# Altium project baseControl.PrjPCB
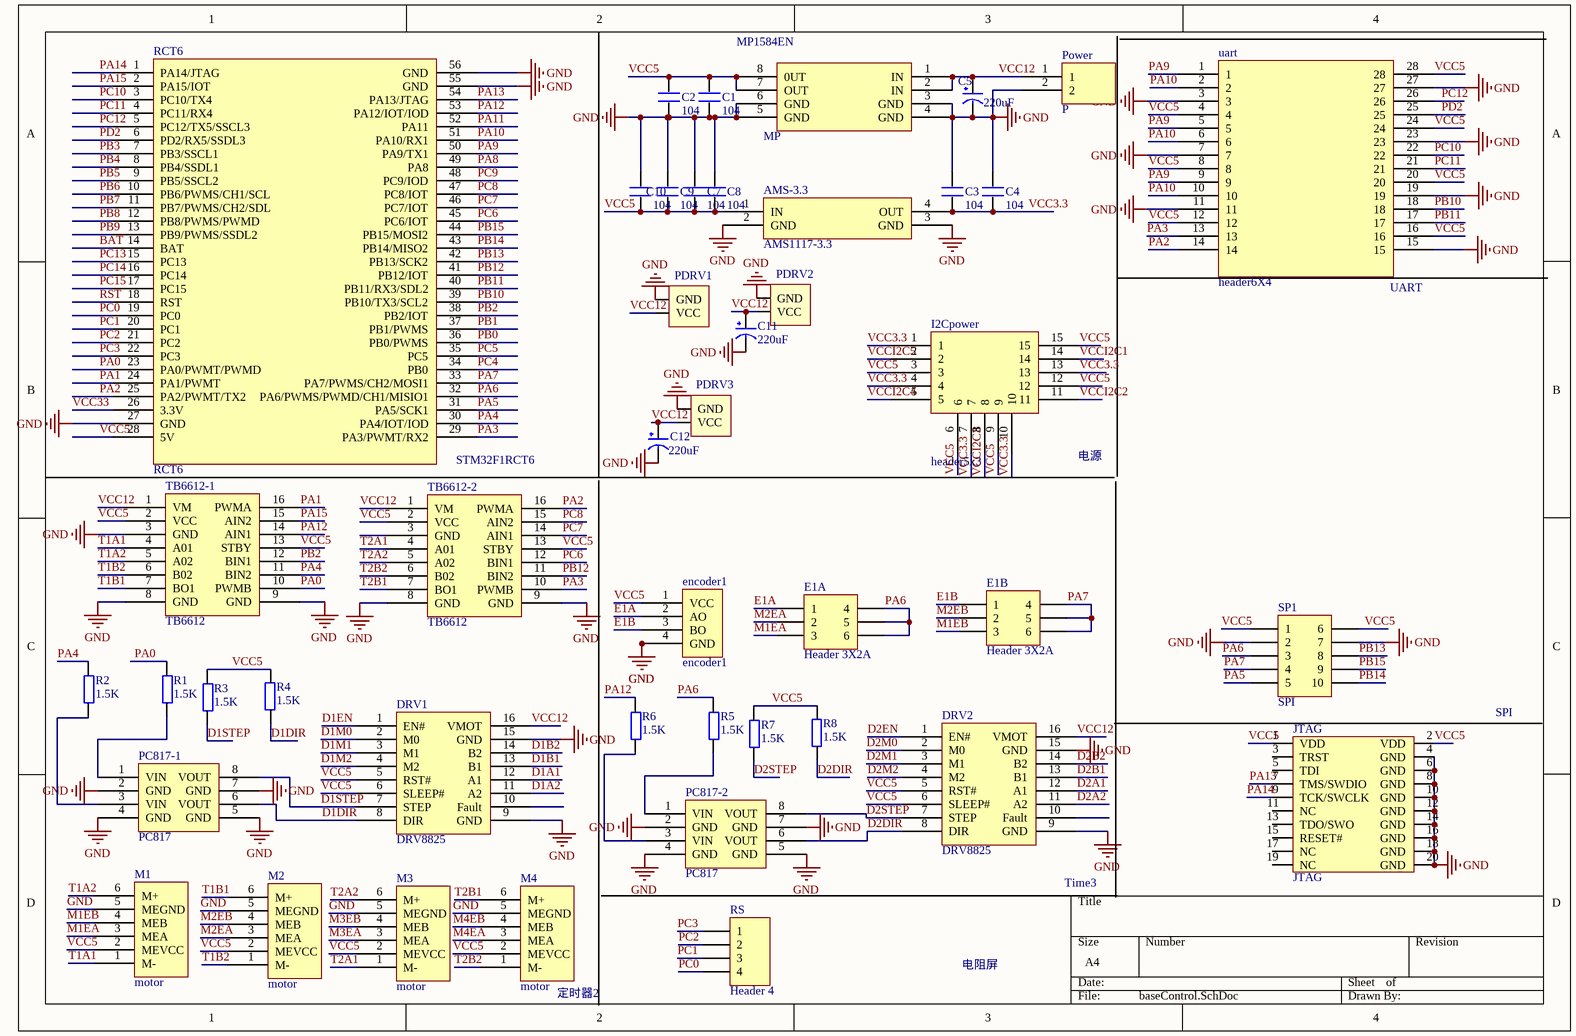
[diagram p0: baseControl.SchDoc]
3 sheets, 83 parts. Net scope: global (net labels, ports and power ports of the same name join across sheets).
Board file: baseControl.~(38).~(49).PcbDoc
Sheets:
  baseControl.SchDoc
  baseControl2.SchDoc
  basecontrol3.SchDoc

## Sheet baseControl.SchDoc
size A4

### Parts
AMS-3.3  AMS1117-3.3  [AMS1117-3.3]
C1  104  [0603P]
C2  104  [0603P]
C3  104  [0603P]
C4  104  [0603P]
C5  220uF  [220 25V]
C7  104  [0805]
C8  104  [0805]
C9  104  [0805]
C10  104  [0805]
C11  220uF  [220 25V]
C12  220uF  [220 25V]
DRV1  DRV8825  [DRV8825]
DRV2  DRV8825  [DRV8825]
E1A  Header 3X2A  [HDR2X3_CEN]
E1B  Header 3X2A  [HDR2X3_CEN]
encoder1  encoder1  [XH-4-254]
I2Cpower  header5x3  [header5X3]
JTAG  JTAG  [JTAG_20]
M1  motor  [XH-6-254]
M2  motor  [XH-6-254]
M3  motor  [XH-6-254]
M4  motor  [XH-6-254]
MP  MP1584EN  [MP1584EN]
PC817-1  PC817  [DIP4]
PC817-2  PC817  [DIP4]
PDRV1  XH2.54-2P  [XH2.54-2P]  (value not drawn)
PDRV2  XH2.54-2P  [XH2.54-2P]  (value not drawn)
PDRV3  XH2.54-2P  [XH2.54-2P]  (value not drawn)
Power  P  [Power]
R1  1.5K  [0603P]
R2  1.5K  [0603P]
R3  1.5K  [0603P]
R4  1.5K  [0603P]
R5  1.5K  [0603P]
R6  1.5K  [0603P]
R7  1.5K  [0603P]
R8  1.5K  [0603P]
RCT6  RCT6  [STM32F1RCT6]
RS  Header 4  [HDR1X4]
SP1  SPI  [HDR2X5_CEN]
TB6612-1  TB6612  [TB6612]
TB6612-2  TB6612  [TB6612]
uart  header6X4  [header7X4]

### Nets
GND: AMS-3.3.2(GND) AMS-3.3.3(GND) C1.2 C2.2 C3.2 C4.2 C5.2(GND) C7.2 C8.2 C9.2 C10.2 C11.2(GND) C12.2(GND) DRV1.9(GND) DRV1.15(GND) DRV2.9(GND) DRV2.15(GND) encoder1.4(GND) JTAG.4(GND) JTAG.6(GND) JTAG.8(GND) JTAG.10(GND) JTAG.12(GND) JTAG.14(GND) JTAG.16(GND) JTAG.18(GND) JTAG.20(GND) M1.5(MEGND) M2.5(MEGND) M3.5(MEGND) M4.5(MEGND) MP.3(GND) MP.4(GND) MP.5(GND) MP.6(GND) PC817-1.2(GND) PC817-1.4(GND) PC817-1.5(GND) PC817-1.7(GND) PC817-2.2(GND) PC817-2.4(GND) PC817-2.5(GND) PC817-2.7(GND) PDRV1.1(GND) PDRV2.1(GND) PDRV3.1(GND) Power.2 RCT6.27(GND) RCT6.55(GND) RCT6.56(GND) SP1.2 SP1.7 TB6612-1.3(GND) TB6612-1.8(GND) TB6612-1.9(GND) TB6612-2.8(GND) TB6612-2.9(GND) uart.3 uart.7 uart.11 uart.15 uart.19 uart.23 uart.27
BAT: RCT6.14(BAT)
D1A1: DRV1.12(A1)
D1A2: DRV1.11(A2)
D1B1: DRV1.13(B1)
D1B2: DRV1.14(B2)
D1DIR: DRV1.8(DIR) PC817-1.6(VOUT) R4.2
D1EN: DRV1.1(EN#)
D1M0: DRV1.2(M0)
D1M1: DRV1.3(M1)
D1M2: DRV1.4(M2)
D1STEP: DRV1.7(STEP) PC817-1.8(VOUT) R3.1
D2A1: DRV2.12(A1)
D2A2: DRV2.11(A2)
D2B1: DRV2.13(B1)
D2B2: DRV2.14(B2)
D2DIR: DRV2.8(DIR) PC817-2.6(VOUT) R8.2
D2EN: DRV2.1(EN#)
D2M0: DRV2.2(M0)
D2M1: DRV2.3(M1)
D2M2: DRV2.4(M2)
D2STEP: DRV2.7(STEP) PC817-2.8(VOUT) R7.1
E1A: E1A.1 encoder1.2(AO)
E1B: E1B.1 encoder1.3(BO)
M1EA: E1A.3 M1.3(MEA)
M1EB: E1B.3 M1.4(MEB)
M2EA: E1A.2 M2.3(MEA)
M2EB: E1B.2 M2.4(MEB)
M3EA: M3.3(MEA)
M3EB: M3.4(MEB)
M4EA: M4.3(MEA)
M4EB: M4.4(MEB)
PA0: R1.2 RCT6.23(PA0/PWMT/PWMD) TB6612-1.10(PWMB)
PA1: RCT6.24(PA1/PWMT) TB6612-1.16(PWMA)
PA2: RCT6.25(PA2/PWMT/TX2) TB6612-2.16(PWMA) uart.14
PA3: RCT6.29(PA3/PWMT/RX2) TB6612-2.10(PWMB) uart.13
PA4: R2.2 RCT6.30(PA4/IOT/IOD) TB6612-1.11(BIN2)
PA5: RCT6.31(PA5/SCK1) SP1.5
PA6: E1A.4 E1A.5 E1A.6 R5.2 RCT6.32(PA6/PWMS/PWMD/CH1/MISIO1) SP1.3
PA7: E1B.4 E1B.5 E1B.6 RCT6.33(PA7/PWMS/CH2/MOSI1) SP1.4
PA8: RCT6.49(PA8)
PA9: RCT6.50(PA9/TX1) uart.1 uart.5 uart.9
PA10: RCT6.51(PA10/RX1) uart.2 uart.6 uart.10
PA11: RCT6.52(PA11)
PA12: R6.2 RCT6.53(PA12/IOT/IOD) TB6612-1.14(AIN1)
PA13: JTAG.7(TMS/SWDIO) RCT6.54(PA13/JTAG)
PA14: JTAG.9(TCK/SWCLK) RCT6.1(PA14/JTAG)
PA15: RCT6.2(PA15/IOT) TB6612-1.15(AIN2)
PB0: RCT6.36(PB0/PWMS)
PB1: RCT6.37(PB1/PWMS)
PB2: RCT6.38(PB2/IOT) TB6612-1.12(BIN1)
PB3: RCT6.7(PB3/SSCL1)
PB4: RCT6.8(PB4/SSDL1)
PB5: RCT6.9(PB5/SSCL2)
PB6: RCT6.10(PB6/PWMS/CH1/SCL)
PB7: RCT6.11(PB7/PWMS/CH2/SDL)
PB8: RCT6.12(PB8/PWMS/PWMD)
PB9: RCT6.13(PB9/PWMS/SSDL2)
PB10: RCT6.39(PB10/TX3/SCL2) uart.18
PB11: RCT6.40(PB11/RX3/SDL2) uart.17
PB12: RCT6.41(PB12/IOT) TB6612-2.11(BIN2)
PB13: RCT6.42(PB13/SCK2) SP1.8
PB14: RCT6.43(PB14/MISO2) SP1.10
PB15: RCT6.44(PB15/MOSI2) SP1.9
PC0: RCT6.19(PC0) RS.4
PC1: RCT6.20(PC1) RS.3
PC2: RCT6.21(PC2) RS.2
PC3: RCT6.22(PC3) RS.1
PC4: RCT6.34(PB0)
PC5: RCT6.35(PC5)
PC6: RCT6.45(PC6/IOT) TB6612-2.12(BIN1)
PC7: RCT6.46(PC7/IOT) TB6612-2.14(AIN1)
PC8: RCT6.47(PC8/IOT) TB6612-2.15(AIN2)
PC9: RCT6.48(PC9/IOD)
PC10: RCT6.3(PC10/TX4) uart.22
PC11: RCT6.4(PC11/RX4) uart.21
PC12: RCT6.5(PC12/TX5/SSCL3) uart.26
PC13: RCT6.15(PC13)
PC14: RCT6.16(PC14)
PC15: RCT6.17(PC15)
PD2: RCT6.6(PD2/RX5/SSDL3) uart.25
RST: RCT6.18(RST)
T1A1: M1.1(M-) TB6612-1.4(A01)
T1A2: M1.6(M+) TB6612-1.5(A02)
T1B1: M2.6(M+) TB6612-1.7(BO1)
T1B2: M2.1(M-) TB6612-1.6(B02)
T2A1: M3.1(M-) TB6612-2.4(A01)
T2A2: M3.6(M+) TB6612-2.5(A02)
T2B1: M4.6(M+) TB6612-2.7(BO1)
T2B2: M4.1(M-) TB6612-2.6(B02)
VCC3.3: AMS-3.3.4(OUT) C3.1 C4.1 I2Cpower.1 I2Cpower.4 I2Cpower.7 I2Cpower.10 I2Cpower.13
VCC5: AMS-3.3.1(IN) C1.1 C2.1 C7.1 C8.1 C9.1 C10.1 DRV1.5(RST#) DRV1.6(SLEEP#) DRV2.5(RST#) DRV2.6(SLEEP#) encoder1.1(VCC) I2Cpower.3 I2Cpower.6 I2Cpower.9 I2Cpower.12 I2Cpower.15 JTAG.1(VDD) JTAG.2(VDD) M1.2(MEVCC) M2.2(MEVCC) M3.2(MEVCC) M4.2(MEVCC) MP.7(OUT) MP.8(0UT) R3.2 R4.1 R7.2 R8.1 RCT6.28(5V) SP1.1 SP1.6 TB6612-1.2(VCC) TB6612-1.13(STBY) TB6612-2.2(VCC) TB6612-2.13(STBY) uart.4 uart.8 uart.12 uart.16 uart.20 uart.24 uart.28
VCC12: C5.1(VCC) C11.1(VCC) C12.1(VCC) DRV1.16(VMOT) DRV2.16(VMOT) MP.1(IN) MP.2(IN) PDRV1.2(VCC) PDRV2.2(VCC) PDRV3.2(VCC) Power.1 TB6612-1.1(VM) TB6612-2.1(VM)
VCC33: RCT6.26(3.3V)
VCCI2C1: I2Cpower.14
VCCI2C2: I2Cpower.11
VCCI2C3: I2Cpower.8
VCCI2C4: I2Cpower.5
VCCI2C5: I2Cpower.2
NetPC817-1_1: PC817-1.1(VIN) R1.1
NetPC817-1_3: PC817-1.3(VIN) R2.1
NetPC817-2_1: PC817-2.1(VIN) R5.1
NetPC817-2_3: PC817-2.3(VIN) R6.1

Not connected (* = marked no-connect by the designer): DRV1 10(Fault); DRV2 10(Fault); JTAG 3(TRST) 5(TDI) 11(NC) 13(TDO/SWO) 15(RESET#) 17(NC) 19(NC); TB6612-2 3(GND)

### Notes on the sheet
- (near uart) UART
- STM32F1RCT6
- 电源
- SPI
- (near DRV2) Time3
- 电阻屏
- (near M4) 定时器2

### Library data of the parts
C1-C4 C7-C10 = C
C5 C11 C12 = CAP
E1A E1B = Header 3X2A: Header, 3-Pin, Dual row; LatestRevisionDate: 17-Jul-2002; LatestRevisionNote: Re-released for DXP Platform.; Publisher: Altium Limited
encoder1 = encoder
JTAG = JTAG_20
M1-M4 = XH-6-254
Power = Power
R1-R8 = R
RCT6 = STM32F1RCT6
RS = Header 4: Header, 4-Pin; LatestRevisionDate: 17-Jul-2002; LatestRevisionNote: Re-released for DXP Platform.; Publisher: Altium Limited
SP1 = Header 5X2A: Header, 5-Pin, Dual row; LatestRevisionDate: 17-Jul-2002; LatestRevisionNote: Re-released for DXP Platform.; Publisher: Altium Limited

## Sheet baseControl2.SchDoc
size A4
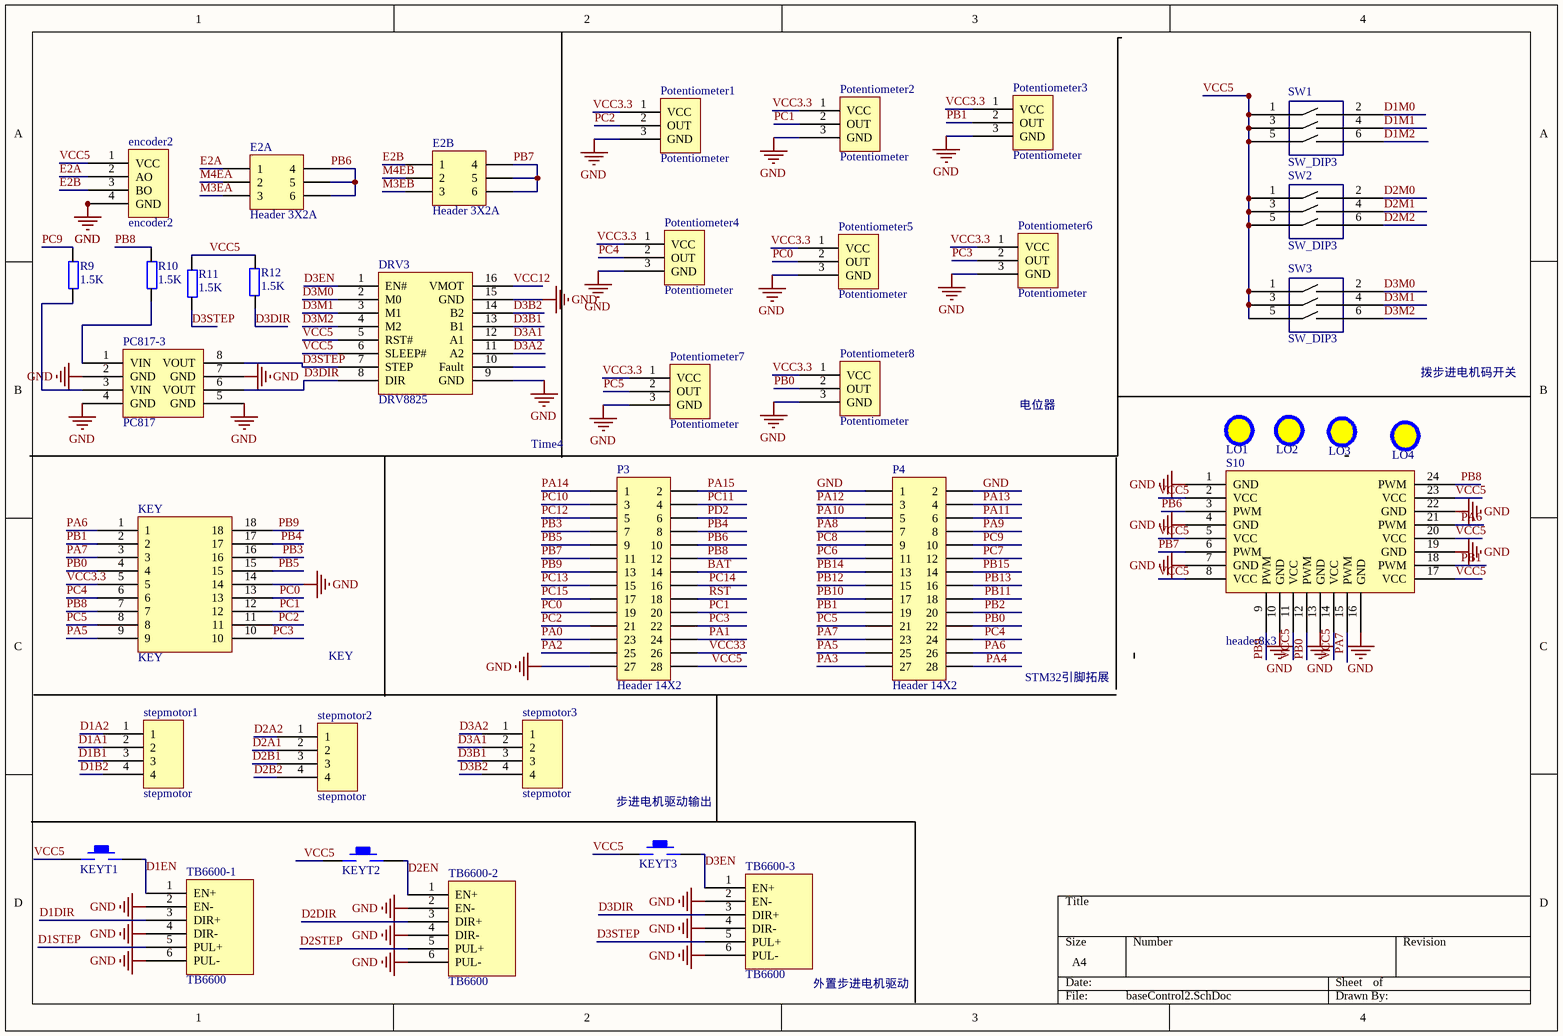
[diagram p1: baseControl2.SchDoc]

### Parts
DRV3  DRV8825  [DRV8825]
E2A  Header 3X2A  [HDR2X3_CEN]
E2B  Header 3X2A  [HDR2X3_CEN]
encoder2  encoder2  [XH-4-254]
KEY  KEY  [KEY]
KEYT1  KEY  [KEY_M]  (value not drawn)
KEYT2  KEY  [KEY_M]  (value not drawn)
KEYT3  KEY  [KEY_M]  (value not drawn)
LO1  螺丝孔  [VIA]  (value not drawn)
LO2  螺丝孔  [VIA]  (value not drawn)
LO3  螺丝孔  [VIA]  (value not drawn)
LO4  螺丝孔  [VIA]  (value not drawn)
P3  Header 14X2  [HDR2X14]
P4  Header 14X2  [HDR2X14]
PC817-3  PC817  [DIP4]
Potentiometer1  Potentiometer  [Potentiometer]
Potentiometer2  Potentiometer  [Potentiometer]
Potentiometer3  Potentiometer  [Potentiometer]
Potentiometer4  Potentiometer  [Potentiometer]
Potentiometer5  Potentiometer  [Potentiometer]
Potentiometer6  Potentiometer  [Potentiometer]
Potentiometer7  Potentiometer  [Potentiometer]
Potentiometer8  Potentiometer  [Potentiometer]
R9  1.5K  [0603P]
R10  1.5K  [0603P]
R11  1.5K  [0603P]
R12  1.5K  [0603P]
S10  header8x3  [header8X3]
stepmotor1  stepmotor  [XH-4-254]
stepmotor2  stepmotor  [XH-4-254]
stepmotor3  stepmotor  [XH-4-254]
SW1  SW_DIP3  [SW_DIP3]
SW2  SW_DIP3  [SW_DIP3]
SW3  SW_DIP3  [SW_DIP3]
TB6600-1  TB6600  [XH-6-254]
TB6600-2  TB6600  [XH-6-254]
TB6600-3  TB6600  [XH-6-254]

### Nets
GND: DRV3.9(GND) DRV3.15(GND) encoder2.4(GND) KEY.14 P3.27 P4.1 P4.2 PC817-3.2(GND) PC817-3.4(GND) PC817-3.5(GND) PC817-3.7(GND) Potentiometer1.3(GND) Potentiometer2.3(GND) Potentiometer3.3(GND) Potentiometer4.3(GND) Potentiometer5.3(GND) Potentiometer6.3(GND) Potentiometer7.3(GND) Potentiometer8.3(GND) S10.1(GND) S10.4(GND) S10.7(GND) S10.10(GND) S10.13(GND) S10.16(GND) S10.19(GND) S10.22(GND) TB6600-1.2(EN-) TB6600-1.4(DIR-) TB6600-1.6(PUL-) TB6600-2.2(EN-) TB6600-2.4(DIR-) TB6600-2.6(PUL-) TB6600-3.2(EN-) TB6600-3.4(DIR-) TB6600-3.6(PUL-)
BAT: P3.14
D1A1: stepmotor1.2
D1A2: stepmotor1.1
D1B1: stepmotor1.3
D1B2: stepmotor1.4
D1DIR: TB6600-1.3(DIR+)
D1EN: KEYT1.2 TB6600-1.1(EN+)
D1M0: SW1.2
D1M1: SW1.4
D1M2: SW1.6
D1STEP: TB6600-1.5(PUL+)
D2A1: stepmotor2.2
D2A2: stepmotor2.1
D2B1: stepmotor2.3
D2B2: stepmotor2.4
D2DIR: TB6600-2.3(DIR+)
D2EN: KEYT2.2 TB6600-2.1(EN+)
D2M0: SW2.2
D2M1: SW2.4
D2M2: SW2.6
D2STEP: TB6600-2.5(PUL+)
D3A1: DRV3.12(A1) stepmotor3.2
D3A2: DRV3.11(A2) stepmotor3.1
D3B1: DRV3.13(B1) stepmotor3.3
D3B2: DRV3.14(B2) stepmotor3.4
D3DIR: DRV3.8(DIR) PC817-3.6(VOUT) R12.2 TB6600-3.3(DIR+)
D3EN: DRV3.1(EN#) KEYT3.2 TB6600-3.1(EN+)
D3M0: DRV3.2(M0) SW3.2
D3M1: DRV3.3(M1) SW3.4
D3M2: DRV3.4(M2) SW3.6
D3STEP: DRV3.7(STEP) PC817-3.8(VOUT) R11.1 TB6600-3.5(PUL+)
E2A: E2A.1 encoder2.2(AO)
E2B: E2B.1 encoder2.3(BO)
M3EA: E2A.3
M3EB: E2B.3
M4EA: E2A.2
M4EB: E2B.2
PA0: P3.23
PA1: P3.24
PA2: P3.25
PA3: P4.27
PA4: P4.28
PA5: KEY.9 P4.25
PA6: KEY.1 P4.26 S10.21(PWM)
PA7: KEY.3 P4.23 S10.15(PWM)
PA8: P4.7
PA9: P4.8
PA10: P4.5
PA11: P4.6
PA12: P4.3
PA13: P4.4
PA14: P3.1
PA15: P3.2
PB0: KEY.4 P4.22 Potentiometer8.2(OUT) S10.12(PWM)
PB1: KEY.2 P4.19 Potentiometer3.2(OUT) S10.18(PWM)
PB2: P4.20
PB3: KEY.16 P3.7
PB4: KEY.17 P3.8
PB5: KEY.15 P3.9
PB6: E2A.4 E2A.5 E2A.6 P3.10 S10.3(PWM)
PB7: E2B.4 E2B.5 E2B.6 P3.11 S10.6(PWM)
PB8: KEY.7 P3.12 R10.2 S10.24(PWM)
PB9: KEY.18 P3.13 S10.9(PWM)
PB10: P4.17
PB11: P4.18
PB12: P4.15
PB13: P4.16
PB14: P4.13
PB15: P4.14
PC0: KEY.13 P3.19 Potentiometer5.2(OUT)
PC1: KEY.12 P3.20 Potentiometer2.2(OUT)
PC2: KEY.11 P3.21 Potentiometer1.2(OUT)
PC3: KEY.10 P3.22 Potentiometer6.2(OUT)
PC4: KEY.6 P4.24 Potentiometer4.2(OUT)
PC5: KEY.8 P4.21 Potentiometer7.2(OUT)
PC6: P4.11
PC7: P4.12
PC8: P4.9
PC9: P4.10 R9.2
PC10: P3.3
PC11: P3.4
PC12: P3.5
PC13: P3.15
PC14: P3.16
PC15: P3.17
PD2: P3.6
RST: P3.18
VCC3.3: KEY.5 Potentiometer1.1(VCC) Potentiometer2.1(VCC) Potentiometer3.1(VCC) Potentiometer4.1(VCC) Potentiometer5.1(VCC) Potentiometer6.1(VCC) Potentiometer7.1(VCC) Potentiometer8.1(VCC)
VCC5: DRV3.5(RST#) DRV3.6(SLEEP#) encoder2.1(VCC) KEYT1.1 KEYT2.1 KEYT3.1 P3.28 R11.2 R12.1 S10.2(VCC) S10.5(VCC) S10.8(VCC) S10.11(VCC) S10.14(VCC) S10.17(VCC) S10.20(VCC) S10.23(VCC) SW1.1 SW1.3 SW1.5 SW2.1 SW2.3 SW2.5 SW3.1 SW3.3 SW3.5
VCC12: DRV3.16(VMOT)
VCC33: P3.26
NetPC817-3_1: PC817-3.1(VIN) R10.1
NetPC817-3_3: PC817-3.3(VIN) R9.1

Not connected (* = marked no-connect by the designer): DRV3 10(Fault)

### Notes on the sheet
- 拨步进电机码开关
- Time4
- 电位器
- KEY
- STM32引脚拓展
- (near KEYT3) 步进电机驱动输出
- 外置步进电机驱动

### Library data of the parts
E2A E2B = Header 3X2A: Header, 3-Pin, Dual row; LatestRevisionDate: 17-Jul-2002; LatestRevisionNote: Re-released for DXP Platform.; Publisher: Altium Limited
encoder2 = encoder
P3 P4 = Header 14X2: Header, 14-Pin, Dual row; LatestRevisionDate: 17-Jul-2002; LatestRevisionNote: Re-released for DXP Platform.; Publisher: Altium Limited
R9-R12 = R

## Sheet basecontrol3.SchDoc
size A4
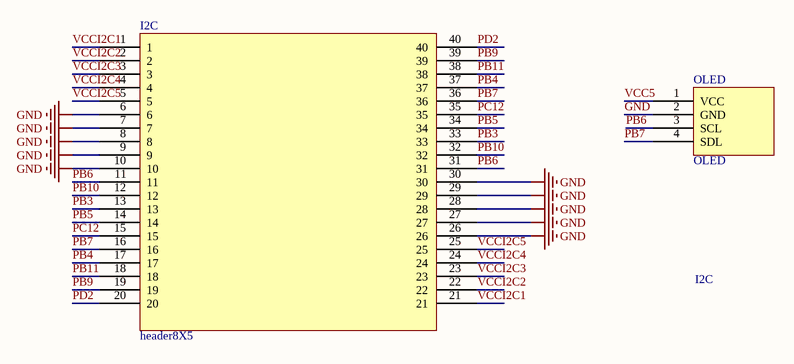
[diagram p2: basecontrol3.SchDoc]

### Parts
I2C  header8X5  [header8X5]
OLED  OLED  [OLED_12864]

### Nets
GND: I2C.6 I2C.7 I2C.8 I2C.9 I2C.10 I2C.26 I2C.27 I2C.28 I2C.29 I2C.30 OLED.2(GND)
PB3: I2C.13 I2C.33
PB4: I2C.17 I2C.37
PB5: I2C.14 I2C.34
PB6: I2C.11 I2C.31 OLED.3(SCL)
PB7: I2C.16 I2C.36 OLED.4(SDL)
PB9: I2C.19 I2C.39
PB10: I2C.12 I2C.32
PB11: I2C.18 I2C.38
PC12: I2C.15 I2C.35
PD2: I2C.20 I2C.40
VCC5: OLED.1(VCC)
VCCI2C1: I2C.1 I2C.21
VCCI2C2: I2C.2 I2C.22
VCCI2C3: I2C.3 I2C.23
VCCI2C4: I2C.4 I2C.24
VCCI2C5: I2C.5 I2C.25

### Notes on the sheet
- I2C

### Library data of the parts
OLED = OLED_12864

## Nets that join several sheets
GND: baseControl (64 pins), baseControl2 (36 pins), basecontrol3 (11 pins)
BAT: baseControl (RCT6.14), baseControl2 (P3.14)
D1A1: baseControl (DRV1.12), baseControl2 (stepmotor1.2)
D1A2: baseControl (DRV1.11), baseControl2 (stepmotor1.1)
D1B1: baseControl (DRV1.13), baseControl2 (stepmotor1.3)
D1B2: baseControl (DRV1.14), baseControl2 (stepmotor1.4)
D1DIR: baseControl (DRV1.8 PC817-1.6 R4.2), baseControl2 (TB6600-1.3)
D1EN: baseControl (DRV1.1), baseControl2 (KEYT1.2 TB6600-1.1)
D1M0: baseControl (DRV1.2), baseControl2 (SW1.2)
D1M1: baseControl (DRV1.3), baseControl2 (SW1.4)
D1M2: baseControl (DRV1.4), baseControl2 (SW1.6)
D1STEP: baseControl (DRV1.7 PC817-1.8 R3.1), baseControl2 (TB6600-1.5)
D2A1: baseControl (DRV2.12), baseControl2 (stepmotor2.2)
D2A2: baseControl (DRV2.11), baseControl2 (stepmotor2.1)
D2B1: baseControl (DRV2.13), baseControl2 (stepmotor2.3)
D2B2: baseControl (DRV2.14), baseControl2 (stepmotor2.4)
D2DIR: baseControl (DRV2.8 PC817-2.6 R8.2), baseControl2 (TB6600-2.3)
D2EN: baseControl (DRV2.1), baseControl2 (KEYT2.2 TB6600-2.1)
D2M0: baseControl (DRV2.2), baseControl2 (SW2.2)
D2M1: baseControl (DRV2.3), baseControl2 (SW2.4)
D2M2: baseControl (DRV2.4), baseControl2 (SW2.6)
D2STEP: baseControl (DRV2.7 PC817-2.8 R7.1), baseControl2 (TB6600-2.5)
M3EA: baseControl (M3.3), baseControl2 (E2A.3)
M3EB: baseControl (M3.4), baseControl2 (E2B.3)
M4EA: baseControl (M4.3), baseControl2 (E2A.2)
M4EB: baseControl (M4.4), baseControl2 (E2B.2)
PA0: baseControl (R1.2 RCT6.23 TB6612-1.10), baseControl2 (P3.23)
PA1: baseControl (RCT6.24 TB6612-1.16), baseControl2 (P3.24)
PA2: baseControl (RCT6.25 TB6612-2.16 uart.14), baseControl2 (P3.25)
PA3: baseControl (RCT6.29 TB6612-2.10 uart.13), baseControl2 (P4.27)
PA4: baseControl (R2.2 RCT6.30 TB6612-1.11), baseControl2 (P4.28)
PA5: baseControl (RCT6.31 SP1.5), baseControl2 (KEY.9 P4.25)
PA6: baseControl (6 pins), baseControl2 (KEY.1 P4.26 S10.21)
PA7: baseControl (5 pins), baseControl2 (KEY.3 P4.23 S10.15)
PA8: baseControl (RCT6.49), baseControl2 (P4.7)
PA9: baseControl (RCT6.50 uart.1 uart.5 uart.9), baseControl2 (P4.8)
PA10: baseControl (RCT6.51 uart.2 uart.6 uart.10), baseControl2 (P4.5)
PA11: baseControl (RCT6.52), baseControl2 (P4.6)
PA12: baseControl (R6.2 RCT6.53 TB6612-1.14), baseControl2 (P4.3)
PA13: baseControl (JTAG.7 RCT6.54), baseControl2 (P4.4)
PA14: baseControl (JTAG.9 RCT6.1), baseControl2 (P3.1)
PA15: baseControl (RCT6.2 TB6612-1.15), baseControl2 (P3.2)
PB0: baseControl (RCT6.36), baseControl2 (KEY.4 P4.22 Potentiometer8.2 S10.12)
PB1: baseControl (RCT6.37), baseControl2 (KEY.2 P4.19 Potentiometer3.2 S10.18)
PB2: baseControl (RCT6.38 TB6612-1.12), baseControl2 (P4.20)
PB3: baseControl (RCT6.7), baseControl2 (KEY.16 P3.7), basecontrol3 (I2C.13 I2C.33)
PB4: baseControl (RCT6.8), baseControl2 (KEY.17 P3.8), basecontrol3 (I2C.17 I2C.37)
PB5: baseControl (RCT6.9), baseControl2 (KEY.15 P3.9), basecontrol3 (I2C.14 I2C.34)
PB6: baseControl (RCT6.10), baseControl2 (5 pins), basecontrol3 (I2C.11 I2C.31 OLED.3)
PB7: baseControl (RCT6.11), baseControl2 (5 pins), basecontrol3 (I2C.16 I2C.36 OLED.4)
PB8: baseControl (RCT6.12), baseControl2 (KEY.7 P3.12 R10.2 S10.24)
PB9: baseControl (RCT6.13), baseControl2 (KEY.18 P3.13 S10.9), basecontrol3 (I2C.19 I2C.39)
PB10: baseControl (RCT6.39 uart.18), baseControl2 (P4.17), basecontrol3 (I2C.12 I2C.32)
PB11: baseControl (RCT6.40 uart.17), baseControl2 (P4.18), basecontrol3 (I2C.18 I2C.38)
PB12: baseControl (RCT6.41 TB6612-2.11), baseControl2 (P4.15)
PB13: baseControl (RCT6.42 SP1.8), baseControl2 (P4.16)
PB14: baseControl (RCT6.43 SP1.10), baseControl2 (P4.13)
PB15: baseControl (RCT6.44 SP1.9), baseControl2 (P4.14)
PC0: baseControl (RCT6.19 RS.4), baseControl2 (KEY.13 P3.19 Potentiometer5.2)
PC1: baseControl (RCT6.20 RS.3), baseControl2 (KEY.12 P3.20 Potentiometer2.2)
PC2: baseControl (RCT6.21 RS.2), baseControl2 (KEY.11 P3.21 Potentiometer1.2)
PC3: baseControl (RCT6.22 RS.1), baseControl2 (KEY.10 P3.22 Potentiometer6.2)
PC4: baseControl (RCT6.34), baseControl2 (KEY.6 P4.24 Potentiometer4.2)
PC5: baseControl (RCT6.35), baseControl2 (KEY.8 P4.21 Potentiometer7.2)
PC6: baseControl (RCT6.45 TB6612-2.12), baseControl2 (P4.11)
PC7: baseControl (RCT6.46 TB6612-2.14), baseControl2 (P4.12)
PC8: baseControl (RCT6.47 TB6612-2.15), baseControl2 (P4.9)
PC9: baseControl (RCT6.48), baseControl2 (P4.10 R9.2)
PC10: baseControl (RCT6.3 uart.22), baseControl2 (P3.3)
PC11: baseControl (RCT6.4 uart.21), baseControl2 (P3.4)
PC12: baseControl (RCT6.5 uart.26), baseControl2 (P3.5), basecontrol3 (I2C.15 I2C.35)
PC13: baseControl (RCT6.15), baseControl2 (P3.15)
PC14: baseControl (RCT6.16), baseControl2 (P3.16)
PC15: baseControl (RCT6.17), baseControl2 (P3.17)
PD2: baseControl (RCT6.6 uart.25), baseControl2 (P3.6), basecontrol3 (I2C.20 I2C.40)
RST: baseControl (RCT6.18), baseControl2 (P3.18)
VCC3.3: baseControl (8 pins), baseControl2 (9 pins)
VCC5: baseControl (43 pins), baseControl2 (26 pins), basecontrol3 (OLED.1)
VCC12: baseControl (13 pins), baseControl2 (DRV3.16)
VCC33: baseControl (RCT6.26), baseControl2 (P3.26)
VCCI2C1: baseControl (I2Cpower.14), basecontrol3 (I2C.1 I2C.21)
VCCI2C2: baseControl (I2Cpower.11), basecontrol3 (I2C.2 I2C.22)
VCCI2C3: baseControl (I2Cpower.8), basecontrol3 (I2C.3 I2C.23)
VCCI2C4: baseControl (I2Cpower.5), basecontrol3 (I2C.4 I2C.24)
VCCI2C5: baseControl (I2Cpower.2), basecontrol3 (I2C.5 I2C.25)